# EAGLE design md2pce (EAGLE 6.6.0)
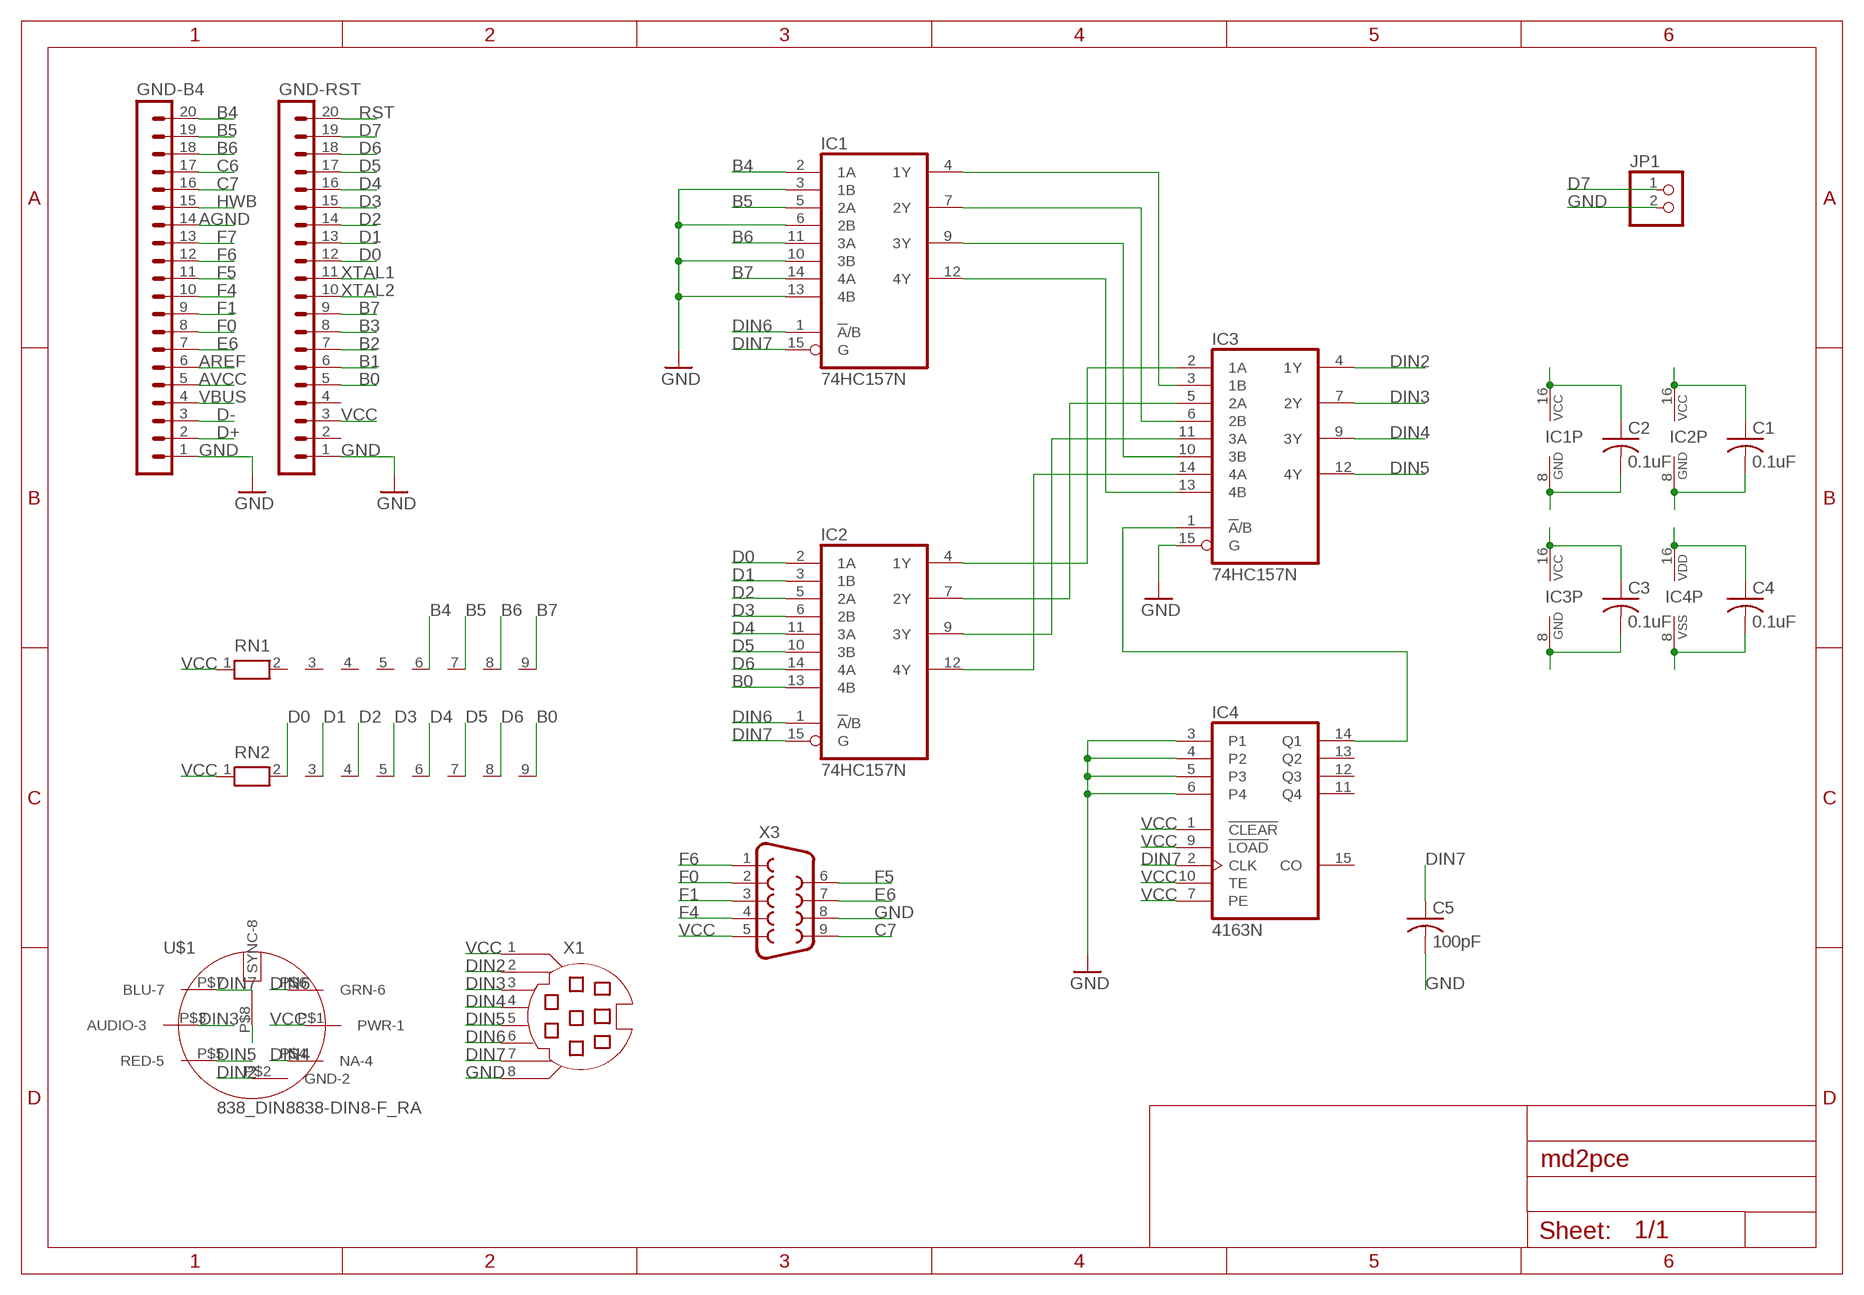
[diagram p0: schematic, sheet 1]

## Parts
C1  0.1uF  C-US025-024X044  [C025-024X044]
C2  0.1uF  C-US025-024X044  [C025-024X044]
C3  0.1uF  C-US025-024X044  [C025-024X044]
C4  0.1uF  C-US025-024X044  [C025-024X044]
C5  100pF  C-US025-024X044  [C025-024X044]
GND-B4  MA20-1  [MA20-1]
GND-RST  MA20-1  [MA20-1]
IC1  74HC157N  [DIL16]
IC2  74HC157N  [DIL16]
IC3  74HC157N  [DIL16]
IC4  4163N  [DIL16]
JP1  PINHD-1X2  [1X02]
RN1  RN08  [RN-9]
RN2  RN08  [RN-9]
U$1  838_DIN8838-DIN8-F_RA  [838_DIN8]
X1  MD08SS  [MDIN08SS]
X3  DB9MALE  [DB9_MALE]

## Nets
AGND: GND-B4.14
AREF: GND-B4.6
AVCC: GND-B4.5
B0: GND-RST.5 IC2.13(4B) RN2.9
B1: GND-RST.6
B2: GND-RST.7
B3: GND-RST.8
B4: GND-B4.20 IC1.2(1A) RN1.6
B5: GND-B4.19 IC1.5(2A) RN1.7
B6: GND-B4.18 IC1.11(3A) RN1.8
B7: GND-RST.9 IC1.14(4A) RN1.9
C6: GND-B4.17
C7: GND-B4.16 X3.9
D0: GND-RST.12 IC2.2(1A) RN2.2
D1: GND-RST.13 IC2.3(1B) RN2.3
D2: GND-RST.14 IC2.5(2A) RN2.4
D3: GND-RST.15 IC2.6(2B) RN2.5
D4: GND-RST.16 IC2.11(3A) RN2.6
D5: GND-RST.17 IC2.10(3B) RN2.7
D6: GND-RST.18 IC2.14(4A) RN2.8
D7: GND-RST.19 JP1.1
D+: GND-B4.2
D-: GND-B4.3
DIN2: IC3.4(1Y) U$1.P$2(GND-2) X1.2
DIN3: IC3.7(2Y) U$1.P$3(AUDIO-3) X1.3
DIN4: IC3.9(3Y) U$1.P$4(NA-4) X1.4
DIN5: IC3.12(4Y) U$1.P$5(RED-5) X1.5
DIN6: IC1.1(!A!/B) IC2.1(!A!/B) U$1.P$6(GRN-6) X1.6
DIN7: C5.1 IC1.15(G) IC2.15(G) IC4.2(CLK) U$1.P$7(BLU-7) X1.7
E6: GND-B4.7 X3.7
F0: GND-B4.8 X3.2
F1: GND-B4.9 X3.3
F4: GND-B4.10 X3.4
F5: GND-B4.11 X3.6
F6: GND-B4.12 X3.1
F7: GND-B4.13
GND: C1.2 C2.2 C3.2 C4.2 C5.2 GND-B4.1 GND-RST.1 IC1.3(1B) IC1.6(2B) IC1.8(GND) IC1.10(3B) IC1.13(4B) IC2.8(GND) IC3.8(GND) IC3.15(G) IC4.3(P1) IC4.4(P2) IC4.5(P3) IC4.6(P4) IC4.8(VSS) JP1.2 U$1.P$8(SYNC-8) X1.8 X3.8
HWB: GND-B4.15
N$1: IC1.4(1Y) IC3.3(1B)
N$2: IC1.7(2Y) IC3.6(2B)
N$3: IC1.9(3Y) IC3.10(3B)
N$4: IC1.12(4Y) IC3.13(4B)
N$5: IC2.4(1Y) IC3.2(1A)
N$6: IC2.7(2Y) IC3.5(2A)
N$7: IC2.9(3Y) IC3.11(3A)
N$8: IC2.12(4Y) IC3.14(4A)
N$9: IC3.1(!A!/B) IC4.14(Q1)
RST: GND-RST.20
VBUS: GND-B4.4
VCC: C1.1 C2.1 C3.1 C4.1 GND-RST.3 IC1.16(VCC) IC2.16(VCC) IC3.16(VCC) IC4.1(!CLEAR) IC4.7(PE) IC4.9(!LOAD) IC4.10(TE) IC4.16(VDD) RN1.1 RN2.1 U$1.P$1(PWR-1) X1.1 X3.5
XTAL1: GND-RST.11
XTAL2: GND-RST.10
Unconnected: GND-RST.2 GND-RST.4 IC4.11(Q4) IC4.12(Q3) IC4.13(Q2) IC4.15(CO) RN1.2 RN1.3 RN1.4 RN1.5

## Library data of the parts
C1-C5 = rcl:C-US: CAPACITOR, American symbol
GND-B4 GND-RST = con-lstb:MA20-1: PIN HEADER; OC_FARNELL: unknown; OC_NEWARK: unknown
IC1-IC3 = 74xx-eu:74*157: Quadruple 2-line to 1-line data SELECTOR/MULTIPLEXER
IC4 = 40xx:4163: Synchronous presettable 4-bit binary COUNTER
JP1 = pinhead:PINHD-1X2: PIN HEADER
RN1 RN2 = resistor-net:RN08: RESISTOR NETWORK; OC_FARNELL: unknown; OC_NEWARK: unknown
U$1 = 838_Components:838_DIN8
X1 = con-yamaichi:MD08SS: YAMAICHI CONNECTOR; OC_FARNELL: unknown; OC_NEWARK: unknown
X3 = SparkFun:DB9: DB9 Connector Standard DB9 (D-Sub 9) serial connector. Can be used for CAN bus as well as RS485 and RS232. Footprint production proven. Spark Fun Electronics SKU : PRT-00429

## Board
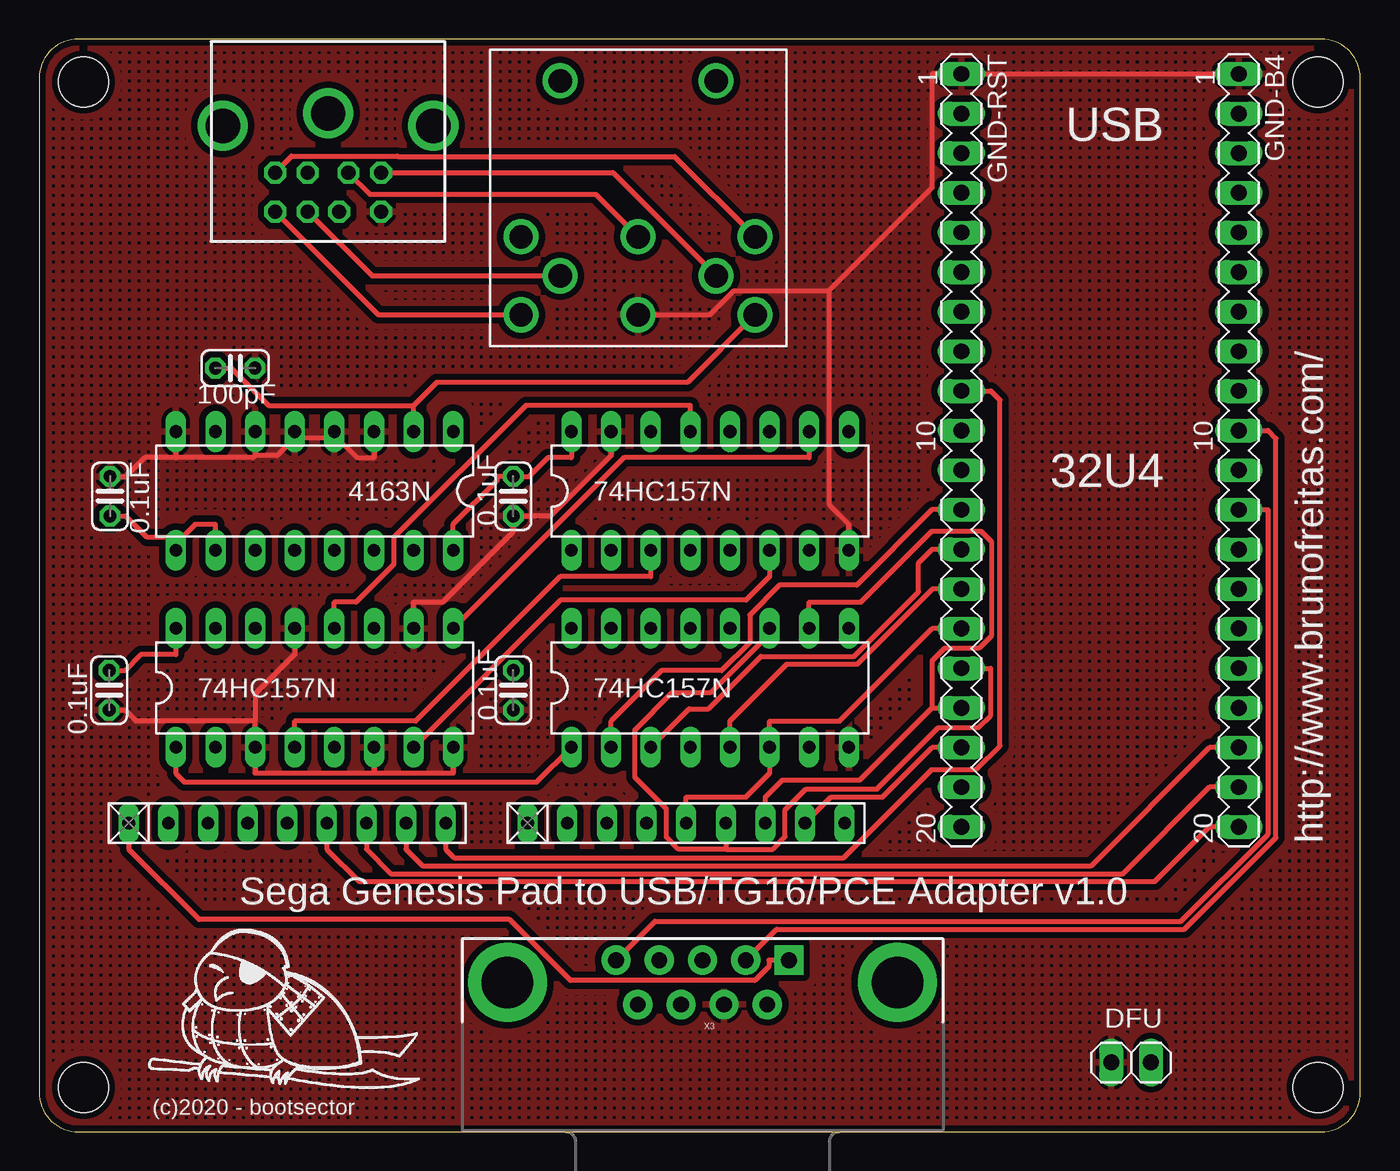
[diagram p1: board, top side]
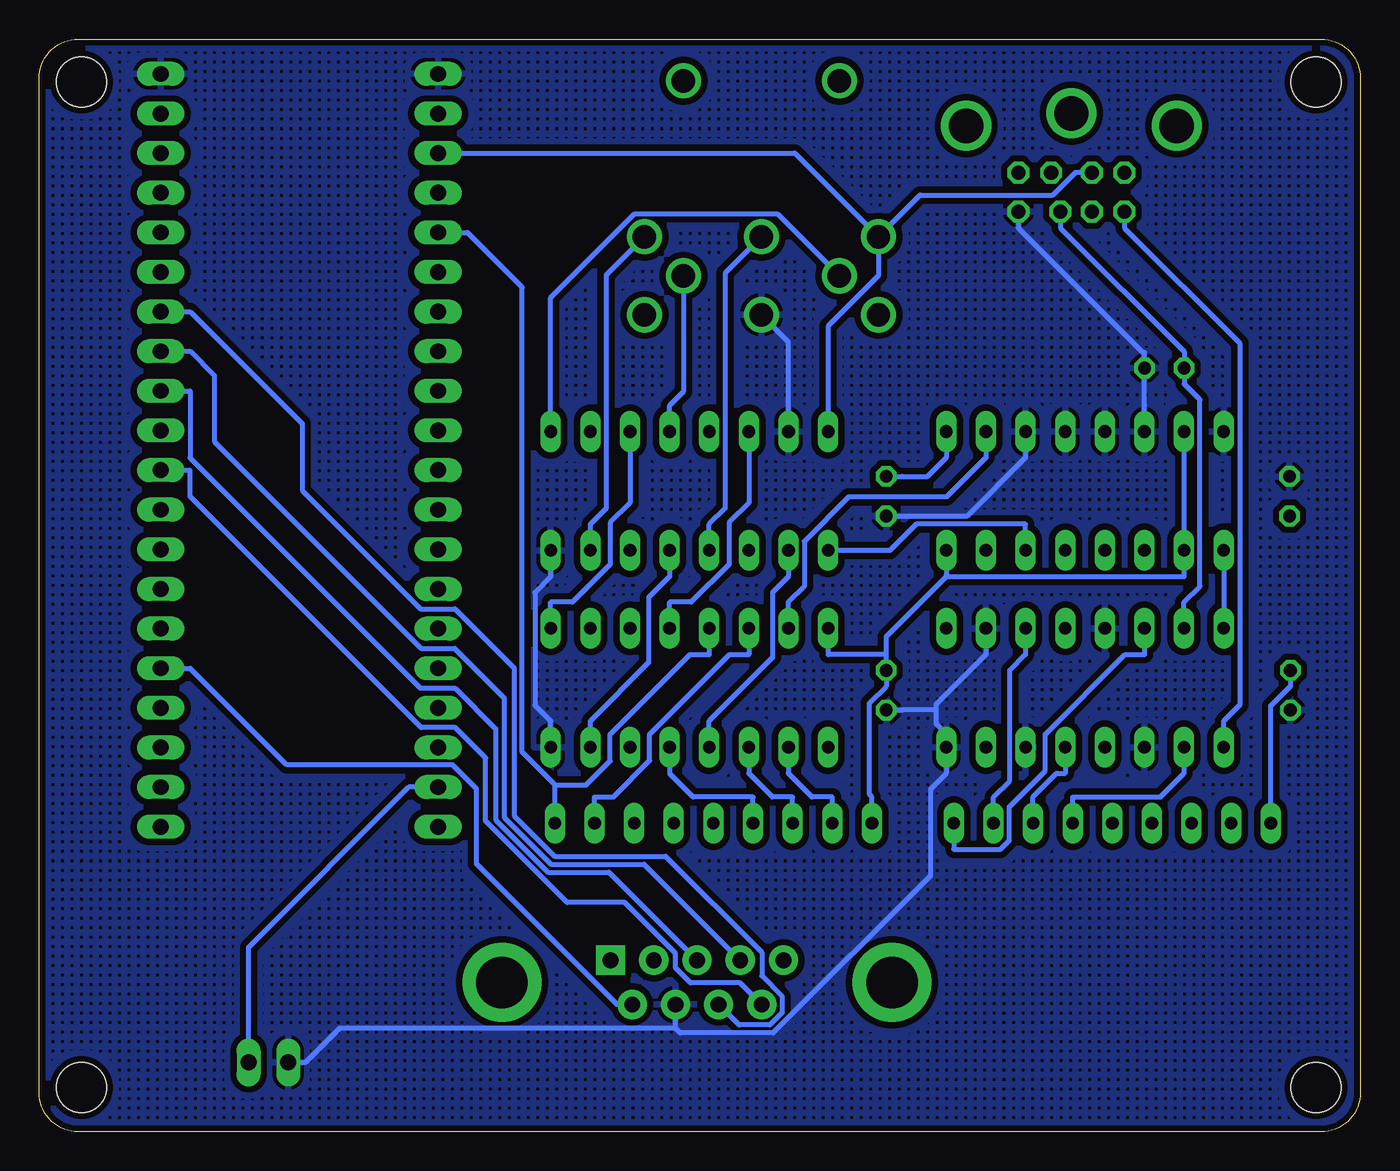
[diagram p2: board, bottom side, seen from below]

Size 84.71 x 70.06 mm. Coordinates in mm from the lower left corner, seen from the top.
Outline: 0,67.52 0,2.54 arc90 2.54,0 82.17,0 arc90 84.71,2.54 84.71,67.52 arc90 82.17,70.06 2.54,70.06 arc90 0,67.52
Copper layers (1*16): Top 0.035mm / dielectric 1.5mm / Bottom 0.035mm
Design rules "SeeedStudio_2layer_DRU_no_angle_20140221": minimum track width 6mil, minimum drill 12mil, track to track 6mil, track to pad 6mil, pad to pad 6mil, via to via 6mil, smd to smd 0mil, copper to edge 10mil, drill to drill 10mil, minimum pad ring 10mil, minimum via ring 6mil, stop-mask expansion 2mil, vias tented up to drill 100mil, thermal gap 10mil
Holes 3.2 mm at 2.85,67.3 2.85,2.85 81.99,2.85 81.99,67.3

### Footprints (pad centres in the part's own frame; a part is rotated, then mirrored left to right if it is on the bottom)
C025-024X044 = drill 0.813 octagon: 1 -1.27,0; 2 1.27,0
MA20-1 = drill 1.016 long: 1 -24.13,0; 2 -21.59,0; 3 -19.05,0; 4 -16.51,0; 5 -13.97,0; 6 -11.43,0; 7 -8.89,0; 8 -6.35,0; 9 -3.81,0; 10 -1.27,0; 11 1.27,0; 12 3.81,0; 13 6.35,0; 14 8.89,0; 15 11.43,0; 16 13.97,0; 17 16.51,0; 18 19.05,0; 19 21.59,0; 20 24.13,0
DIL16 = drill 0.813 long: 1 -8.89,-3.81; 2 -6.35,-3.81; 3 -3.81,-3.81; 4 -1.27,-3.81; 5 1.27,-3.81; 6 3.81,-3.81; 7 6.35,-3.81; 8 8.89,-3.81; 9 8.89,3.81; 10 6.35,3.81; 11 3.81,3.81; 12 1.27,3.81; 13 -1.27,3.81; 14 -3.81,3.81; 15 -6.35,3.81; 16 -8.89,3.81
1X02 = drill 1.016 long: 1 -1.27,0; 2 1.27,0
RN-9 = drill 0.813 long: 1 -10.16,0; 2 -7.62,0; 3 -5.08,0; 4 -2.54,0; 5 0,0; 6 2.54,0; 7 5.08,0; 8 7.62,0; 9 10.16,0
838_DIN8 = drill 1.5: P$1 7.5,-5; P$2 0,-5; P$3 -7.5,-5; P$4 5,-2.5; P$5 -5,-2.5; P$6 7.5,0; P$7 -7.5,0; P$8 0,0; P$9 5,-15; P$10 -5,-15
MDIN08SS = drill 0.9 octagon: 1 1.3,8.5; 2 -1.3,8.5; 3 3.4,8.5; 4 1.3,11; 5 -3.4,8.5; 6 3.4,11; 7 -0.7,11; 8 -3.4,11 | drill 2.2: P$1 -6.75,5.5; P$2 0,4.7; P$3 6.75,5.5
DB9_MALE = drill 1.016 pad 1.88: 1 5.54,-1.42; 2 2.77,-1.42; 3 0,-1.42; 4 -2.77,-1.42; 6 4.15,1.42; 7 1.38,1.42; 8 -1.38,1.42; 9 -4.15,1.42 | drill 1.016 pad 1.88 square: 5 -5.54,-1.42 | drill 3.302 pad 5.08: G1 -12.5,0; G2 12.5,0

### Placement (x,y rotation side)
C1  4.56,40.75 90 top
C2  30.4,40.75 270 top
C3  4.5,28.32 270 top
C4  30.4,28.32 270 top
C5  12.57,48.97 0 top
GND-B4  76.91,43.69 270 top
GND-RST  59.13,43.69 270 top
IC1  17.66,28.47 0 top
IC2  43.02,28.47 0 top
IC3  43.02,41.09 0 top
IC4  17.66,41.09 180 top
JP1  70.01,4.45 180 top
RN1  15.91,19.8 0 top
RN2  41.48,19.8 0 top
U$1  38.4,52.38 180 top
X1  18.53,70 180 top
X3  42.53,9.59 180 top

### Tracks (layer width: path | path; a pad name or v marks a point on that pad's centre or on a via)
B0
  Bottom 0.305: 51.64,22.23 53.74,24.34 53.74,54.16 57.25,57.66 GND-RST.5 | 51.64,22.23 49.64,22.23 48.1,23.77 48.1,25.49 42.99,30.6 41.75,30.6 IC2.13 | 51.64,22.23 51.64,20.64 RN2.9
B4
  Top 0.305: GND-B4.20 75.03,19.56 71.52,16.05 20.52,16.05 18.45,18.12 RN1.6
  Bottom 0.305: IC1.2 11.31,22.98 12.82,21.47 18.45,21.47 RN1.6
B5
  Top 0.305: GND-B4.19 75.03,22.1 69.48,16.55 22.55,16.55 20.99,18.12 RN1.7
  Bottom 0.305: IC1.5 18.93,22.98 19.48,22.98 20.99,21.47 RN1.7
B6
  Top 0.305: GND-B4.18 75.03,24.64 67.45,17.06 24.59,17.06 23.53,18.12 RN1.8
  Bottom 0.305: IC1.11 21.47,30.6 22.49,29.59 22.49,22.52 23.53,21.47 RN1.8
B7
  Top 0.305: GND-RST.9 61.01,47.5 61.6,46.91 61.6,24.75 60.08,23.23 57.23,23.23 51.58,17.57 26.62,17.57 26.07,18.12 RN1.9
  Bottom 0.305: IC1.14 13.85,30.6 15.09,30.6 20.2,25.49 20.2,23.15 22.51,20.84 22.51,18.68 23.07,18.12 26.07,18.12 RN1.9
C7
  Bottom 0.305: GND-B4.16 75.03,29.72 68.83,23.52 58.2,23.52 56.67,21.99 56.67,17.17 47.66,8.17 X3.9
D0
  Top 0.305: GND-RST.12 57.25,39.88 52.43,35.06 47.48,35.06 45.56,33.14 45.56,31.38 43.77,29.58 39.92,29.58 36.67,26.34 IC2.2
  Bottom 0.305: RN2.2 33.86,21.47 35.16,21.47 36.67,22.98 IC2.2
D1
  Top 0.305: IC2.3 41.68,27.13 42.92,27.13 46.28,30.49 52.25,30.49 56.38,34.62 56.38,36.47 57.25,37.34 GND-RST.13
  Bottom 0.305: RN2.3 36.4,21.47 37.7,21.47 39.21,22.98 IC2.3
D2
  Top 0.305: GND-RST.14 57.25,34.8 57.25,34.77 52.46,29.98 47.94,29.98 44.29,26.34 IC2.5
  Bottom 0.305: IC2.5 44.29,22.98 42.78,21.47 38.94,21.47 RN2.4
D3
  Top 0.305: GND-RST.15 57.25,32.26 51.32,26.34 46.83,26.34 IC2.6 46.83,22.98 45.32,21.47 41.48,21.47 RN2.5
D4
  Top 0.305: GND-RST.16 61.01,29.72 61.01,26.71 60.21,25.91 57.66,25.91 53.73,21.98 49.17,21.98 47.83,20.65 47.83,18.91 47.04,18.12 44.02,18.12 | 44.02,18.12 44.02,18.25 RN2.6 | 44.02,18.12 41,18.12 40.21,18.91 40.21,20.71 38.19,22.73 38.19,25.78 40.58,28.17 43.09,28.17 46.83,31.92 IC2.11
D5
  Top 0.305: 57.25,27.18 GND-RST.17 | 57.25,27.18 52.62,22.56 47.65,22.56 46.56,21.47 RN2.7 | 57.25,27.18 57.25,30.2 58.04,30.99 60.25,30.99 61.04,31.79 61.04,37.85 60.39,38.51 57.23,38.51 52.68,33.95 49.37,33.95 IC2.10
D6
  Top 0.305: GND-RST.18 57.25,24.64 54.08,21.47 50.78,21.47 RN2.8
  Bottom 0.305: IC2.14 39.21,30.6 40.45,30.6 45.56,25.49 45.56,23.8 47.9,21.47 49.1,21.47 RN2.8
D7
  Bottom 0.305: GND-RST.19 61.01,22.1 71.28,11.83 JP1.1
DIN2
  Top 0.305: X1.2 21.22,60.1 35.68,60.1 U$1.P$2
  Bottom 0.305: IC3.4 41.75,38.95 40.74,39.97 40.74,55.05 U$1.P$2
DIN3
  Top 0.305: X1.3 16.19,62.56 22.97,62.56 22.99,62.53 40.75,62.53 U$1.P$3
  Bottom 0.305: IC3.7 49.37,38.95 48.36,39.97 48.36,54.93 U$1.P$3
DIN4
  Top 0.305: X1.4 21.35,54.88 U$1.P$4
  Bottom 0.305: IC3.9 51.91,53.47 46.52,58.86 37.39,58.86 U$1.P$4
DIN5
  Top 0.305: X1.5 36.79,61.5 U$1.P$5
  Bottom 0.305: IC3.12 44.29,46.57 43.41,47.46 U$1.P$5
DIN6
  Top 0.305: IC1.1 8.77,22.98 9.32,22.43 31.91,22.43 IC2.1 | X1.6 21.75,52.38 U$1.P$6
  Bottom 0.305: IC1.1 8.77,26.34 7.75,27.36 7.75,50.56 15.13,57.94 X1.6
DIN7
  Top 0.305: U$1.P$7 41.57,48.04 25.48,48.04 24.01,46.57 | IC4.2 24.01,46.57 | C5.1 12.32,48.97 14.71,46.57 24.01,46.57
  Bottom 0.305: IC2.15 36.67,33.95 35.66,34.97 35.66,37.86 32.81,40.7 26.53,40.7 24.01,43.22 IC4.2 | X1.7 19.23,57.94 11.3,50.01 C5.1 11.3,47.95 10.3,46.94 10.3,34.97 11.31,33.95 IC1.15
E6
  Bottom 0.305: X3.7 39.84,6.85 37.86,6.85 37.08,7.63 37.08,8.69 38.38,9.99 38.38,11.51 44.54,17.67 51.66,17.67 54.25,20.26 54.25,29.73 58.05,33.53 60.25,33.53 67.84,41.12 67.84,45.39 75.03,52.58 GND-B4.7
F0
  Bottom 0.305: X3.2 45.92,17.16 51.87,17.16 54.89,20.17 54.89,27.82 58.06,30.99 60.21,30.99 73.48,44.27 73.48,48.49 75.03,50.04 GND-B4.8
F1
  Bottom 0.305: X3.3 48.18,16.65 52.08,16.65 55.44,20 55.44,25.84 58.05,28.45 60.27,28.45 75.03,43.21 75.03,47.5 GND-B4.9
F4
  Top 0.305: X3.4 47.29,12.99 73.43,12.99 79.3,18.86 79.3,44.45 78.79,44.96 GND-B4.10
F5
  Bottom 0.305: GND-B4.11 75.03,42.42 75.03,40.73 60.21,25.91 58.03,25.91 56.08,23.96 56.08,19.93 50.86,14.71 47.17,14.71 43.92,11.46 43.92,10.53 42.94,9.55 39.77,9.55 X3.6
F6
  Top 0.305: GND-B4.12 78.79,39.88 78.79,19.08 73.2,13.5 39.49,13.5 X3.1
GND
  Top 0.305: C1.2 5.57,42.02 6.77,43.22 8.77,43.22 | 13.85,43.35 13.73,43.22 8.77,43.22 | 16.39,44.48 15.26,43.35 13.85,43.35 | IC4.8 8.77,43.22 | 21.47,22.98 13.85,22.98 IC1.3 13.85,26.34 | 21.47,22.98 21.47,23.11 IC1.6 | 50.64,53.92 50.64,40.22 51.91,38.95 IC3.8 | 50.64,53.92 57.25,60.53 57.25,67.82 GND-RST.1 GND-B4.1 | U$1.P$8 43.01,52.38 44.55,53.92 50.64,53.92 | IC3.15 36.67,43.35 32.81,39.48 31.42,39.48 C2.2 30.4,38.47 25.89,33.95 24.01,33.95 IC1.10 | IC1.13 16.39,30.6 13.85,28.06 13.85,26.34 | IC1.8 26.55,22.98 21.47,22.98 | IC4.3 21.47,43.22 20.4,43.22 18.93,44.69 | 18.93,44.69 18.93,44.48 16.39,44.48 | IC4.4 18.93,44.69 | IC4.6 13.85,43.35 | IC4.5 16.39,44.48 | C3.2 5.51,27.05 6.22,26.34 13.85,26.34
  Bottom 0.305: 43.91,6.64 65.43,6.64 67.62,4.45 JP1.2 | 43.91,6.64 43.61,6.34 37.65,6.34 27.57,16.42 27.57,21.97 26.55,22.98 IC1.8 26.55,25.5 27.2,26.14 27.2,27.05 | 43.91,6.64 X3.8 | IC2.8 51.91,26.34 52.93,27.35 52.93,34.58 51.91,35.6 IC3.8 | C4.2 29.39,27.05 27.2,27.05 | C2.2 25.21,39.48 21.47,43.22 IC4.3 | 27.2,27.05 27.2,27.42 24.01,30.6 IC1.10 | IC3.15 36.67,50.65 U$1.P$8 | X1.8 21.93,57.94 13.98,49.98 13.84,49.98 C5.2 13.84,46.58 13.85,46.57 IC4.6
  pour Bottom (isolate 0.406, hatched): -0.3,70.55 85.02,70.55 85.02,-0.46 -0.3,-0.46
  pour Top (isolate 0.406, hatched): -0.15,70.7 85.18,70.7 85.18,-0.78 -0.15,-0.78
N$1
  Top 0.305: IC1.4 16.39,26.34 24.15,26.34 33.41,35.6 39.21,35.6 IC3.3
N$2
  Top 0.305: IC3.6 46.83,35.6 45.32,34.09 33.44,34.09 IC1.7
N$3
  Top 0.305: IC3.10 49.37,43.22 37.49,43.22 IC1.9
N$4
  Top 0.305: IC1.12 18.93,33.95 20.32,33.95 22.74,36.38 22.74,38.1 31.21,46.57 41.75,46.57 IC3.13
N$5
  Bottom 0.305: IC3.2 36.67,35.6 37.69,34.58 37.69,30.4 41.75,26.34 IC2.4
N$6
  Bottom 0.305: IC2.7 49.37,26.34 45.63,30.08 45.63,34.26 44.29,35.6 IC3.5
N$7
  Bottom 0.305: IC2.9 51.91,33.95 50.52,33.95 48.1,36.38 48.1,39.06 46.83,40.33 IC3.11
N$8
  Bottom 0.305: IC2.12 44.29,33.95 42.9,33.95 40.48,36.38 40.48,39.06 39.21,40.33 IC3.14
N$9
  Bottom 0.305: IC4.14 21.47,38.95 28.48,38.95 30.15,37.28 IC3.1
VCC
  Top 0.305: RN1.1 5.75,18.12 10.25,13.62 30.16,13.62 34.06,9.71 45.89,9.71 46.78,10.6 46.78,11.01 X3.5 | IC4.16 26.55,38.95 29.39,41.79 29.39,42.02 C2.1 31.42,42.02 32.62,43.22 34.13,43.22 IC3.16 | IC4.10 11.31,38.95 10.03,38.95 8.77,37.7 | 8.77,37.7 8.77,38.12 6.94,38.12 5.57,39.48 C1.1 | IC4.9 8.77,37.7 | C3.1 5.51,29.59 6.53,30.6 8.77,30.6 IC1.16
  Bottom 0.305: C3.1 4.5,28.57 5.75,27.32 RN1.1 | 30.4,30.6 30.4,31.75 26.55,35.6 | 30.4,30.6 C4.1 30.4,28.57 31.47,27.5 31.47,21.62 31.32,21.47 RN2.1 | 30.4,30.6 34.13,30.6 IC2.16 | 26.55,35.6 11.31,35.6 IC4.10 IC4.7 | 26.55,35.6 26.55,35.73 IC4.16 | GND-RST.3 36.27,62.74 U$1.P$1 | U$1.P$1 28.23,60.06 19.73,60.06 18.29,61.5 X1.1 | IC4.1 26.55,43.22 27.75,42.02 29.39,42.02 C2.1 | U$1.P$1 30.91,54.88 34.13,51.65 IC3.16 | IC4.9 IC1.16

### Text on the board
tPlace: USB | 32U4 | http://www.brunofreitas.com/ | Sega Genesis Pad to USB/TG16/PCE Adapter v1.0 | DFU | (c)2020 - bootsector